# EAGLE schematic d-cube (EAGLE 7.7.0)

## Sheet 1 of 3: Isolation Circuits for USB, Power and GPIO isolation between the Target and the RPI.
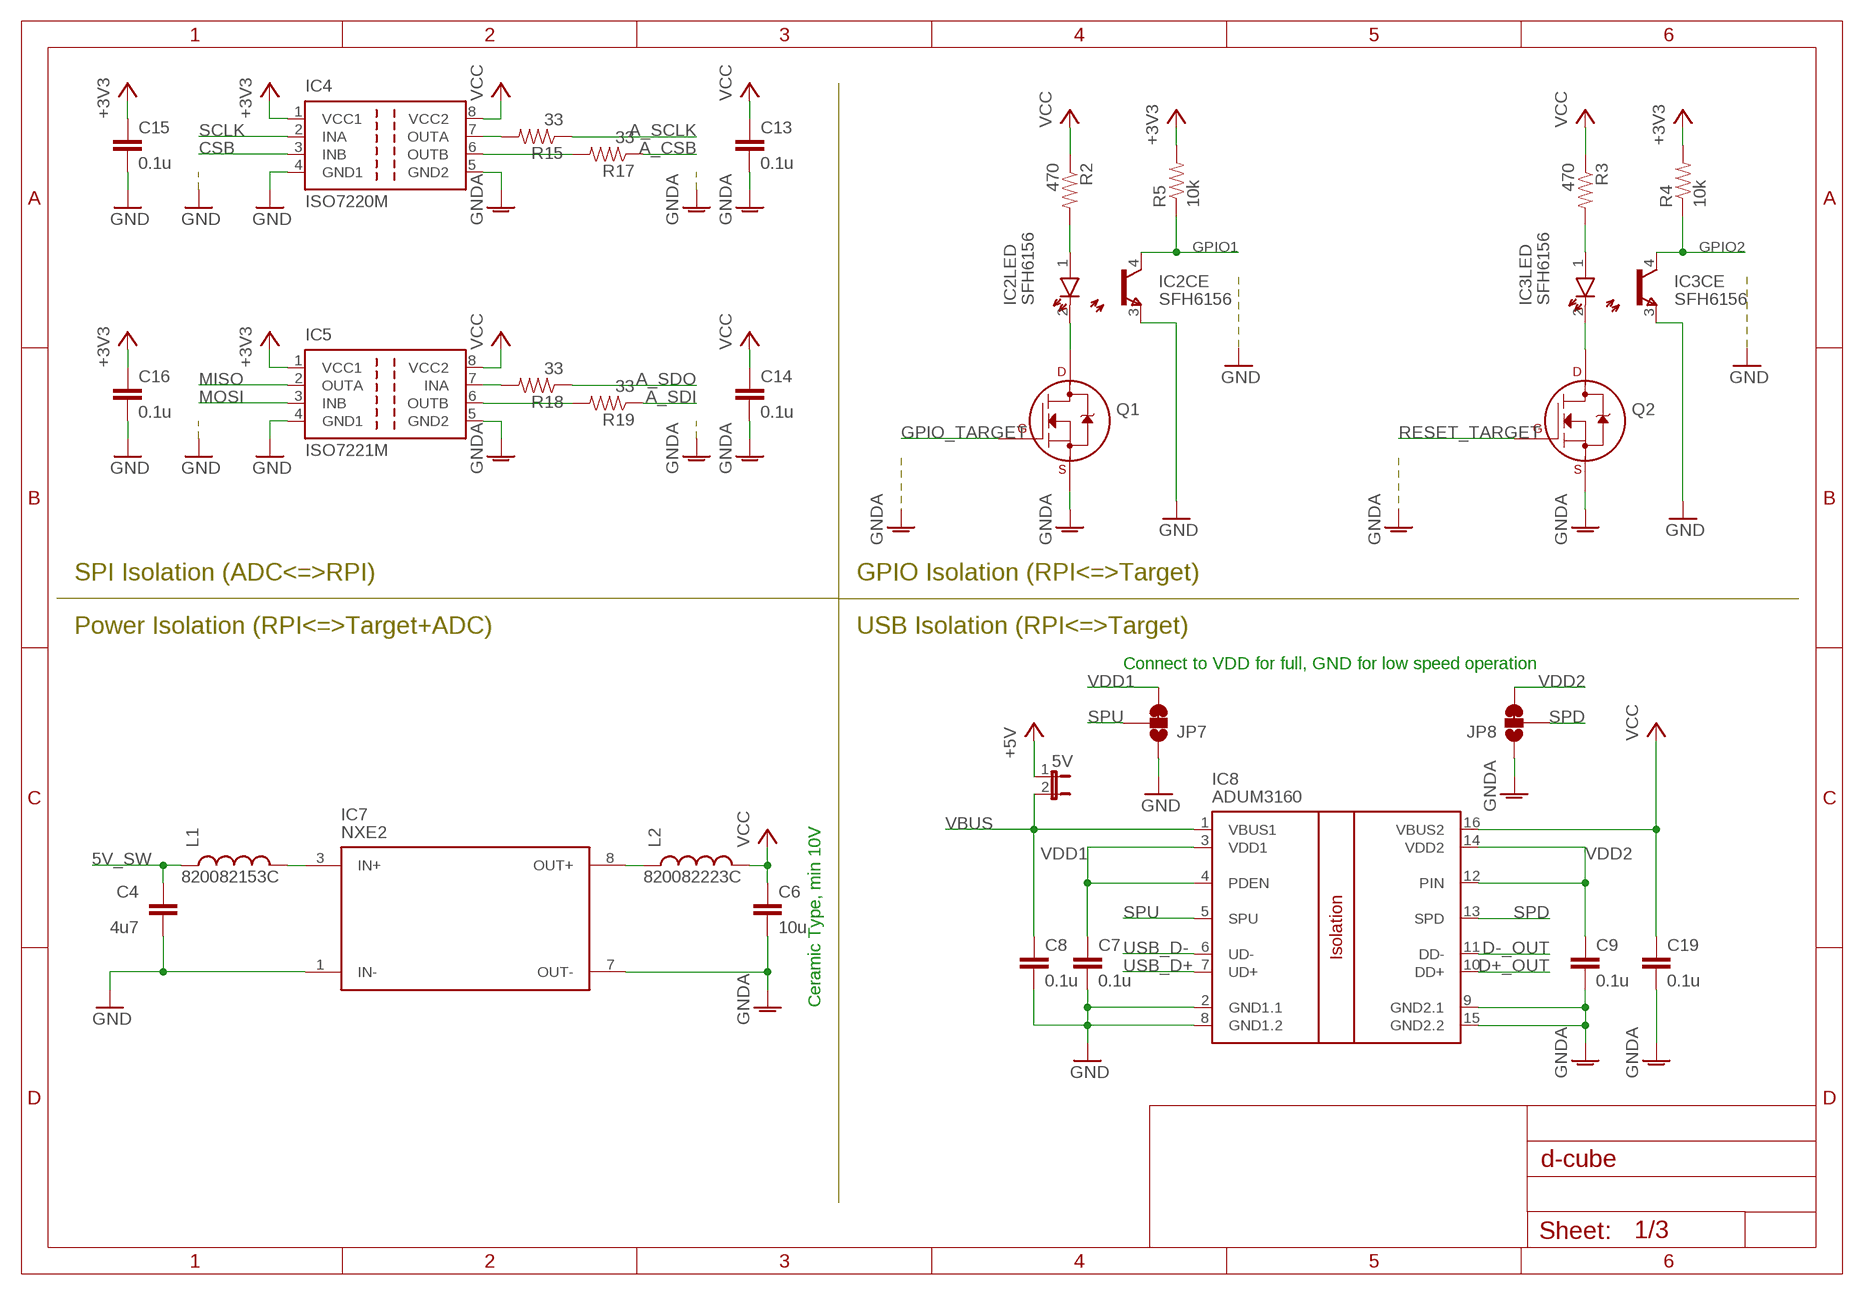
[diagram p0: schematic, sheet 1]

### Parts
5V  JP1E  [JP1]
C4  4u7  CAP0805  [0805]
C6  10u  CAP0805  [0805]
C7  0.1u  CAP0805  [0805]
C8  0.1u  CAP0805  [0805]
C9  0.1u  CAP0805  [0805]
C13  0.1u  CAP0805  [0805]
C14  0.1u  CAP0805  [0805]
C15  0.1u  CAP0805  [0805]
C16  0.1u  CAP0805  [0805]
C19  0.1u  CAP0805  [0805]
IC2  SFH6156  [SFH]
IC3  SFH6156  [SFH]
IC4  ISO7220M  [SO-08]
IC5  ISO7221M  [SO-08]
IC7  NXE2  [NXE2]
IC8  ADUM3160  [SO-16W]
JP7  JUMPER-PAD-3-2OF3_NC_BY_TRACE_LARGE  [PAD-JUMPER-3-2OF3_NC_BY_TRACE_YES_SILK_LARGE]
JP8  JUMPER-PAD-3-2OF3_NC_BY_TRACE_LARGE  [PAD-JUMPER-3-2OF3_NC_BY_TRACE_YES_SILK_LARGE]
L1  820082153C  [8200]
L2  820082223C  [8200]
Q1  2N7002_SOT23  [SOT-23]
Q2  2N7002_SOT23  [SOT-23]
R2  470  RESISTOR0805-RES  [0805]
R3  470  RESISTOR0805-RES  [0805]
R4  10k  RESISTOR0805-RES  [0805]
R5  10k  RESISTOR0805-RES  [0805]
R15  33  RESISTOR0805-RES  [0805]
R17  33  RESISTOR0805-RES  [0805]
R18  33  RESISTOR0805-RES  [0805]
R19  33  RESISTOR0805-RES  [0805]

### Nets
5V_SW: C4.1 L1.P$1 ; also sheet 2
+3V3: C15.1 C16.1 IC4.1(VCC1) IC5.1(VCC1) R4.2 R5.2 ; also sheet 2,3
+5V: 5V.1 ; also sheet 3
A_CSB: R17.1 ; also sheet 2
A_SCLK: R15.1 ; also sheet 2
A_SDI: R19.1 ; also sheet 2
A_SDO: R18.1 ; also sheet 2
CSB: IC4.3(INB) ; also sheet 3
D+_OUT: IC8.10(DD+) ; also sheet 3
D-_OUT: IC8.11(DD-) ; also sheet 3
GND: C4.2 C7.2 C8.2 C15.2 C16.2 IC2.3(CE:E) IC3.3(CE:E) IC4.4(GND1) IC5.4(GND1) IC7.1(IN-) IC8.2(GND1.1) IC8.8(GND1.2) JP7.1 ; also sheet 2,3
GNDA: C6.2 C9.2 C13.2 C14.2 C19.2 IC4.5(GND2) IC5.5(GND2) IC7.7(OUT-) IC8.9(GND2.1) IC8.15(GND2.2) JP8.1 Q1.2(S) Q2.2(S) ; also sheet 2
GPIO1: IC2.4(CE:C) R5.1 ; also sheet 2,3
GPIO2: IC3.4(CE:C) R4.1 ; also sheet 3
GPIO_TARGET: Q1.1(G) ; also sheet 3
MISO: IC5.2(OUTA) ; also sheet 3
MOSI: IC5.3(INB) ; also sheet 3
N$1: IC7.3(IN+) L1.P$2
N$2: IC2.2(LED:K) Q1.3(D)
N$5: IC7.8(OUT+) L2.P$1
N$11: IC2.1(LED:A) R2.2
N$12: IC3.1(LED:A) R3.2
N$14: IC3.2(LED:K) Q2.3(D)
N$17: IC4.7(OUTA) R15.2
N$18: IC4.6(OUTB) R17.2
N$19: IC5.7(INA) R18.2
N$20: IC5.6(OUTB) R19.2
RESET_TARGET: Q2.1(G) ; also sheet 3
SCLK: IC4.2(INA) ; also sheet 3
SPD: IC8.13(SPD) JP8.2
SPU: IC8.5(SPU) JP7.2
USB_D+: IC8.7(UD+) ; also sheet 3
USB_D-: IC8.6(UD-) ; also sheet 3
VBUS: 5V.2 C8.1 IC8.1(VBUS1) ; also sheet 2,3
VCC: C6.1 C13.1 C14.1 C19.1 IC4.8(VCC2) IC5.8(VCC2) IC8.16(VBUS2) L2.P$2 R2.1 R3.1 ; also sheet 2,3
VDD1: C7.1 IC8.3(VDD1) IC8.4(PDEN) JP7.3
VDD2: C9.1 IC8.12(PIN) IC8.14(VDD2) JP8.3

### Notes on the sheet
- SPI Isolation (ADC<=>RPI) | GPIO Isolation (RPI<=>Target)
- Power Isolation (RPI<=>Target+ADC) | USB Isolation (RPI<=>Target)
- Connect to VDD for full, GND for low speed operation
- Ceramic Type, min 10V

## Sheet 2 of 3: Measurement Compoments. Contains the main ADC, the USB power switch and the edge detector required for the Navspark.
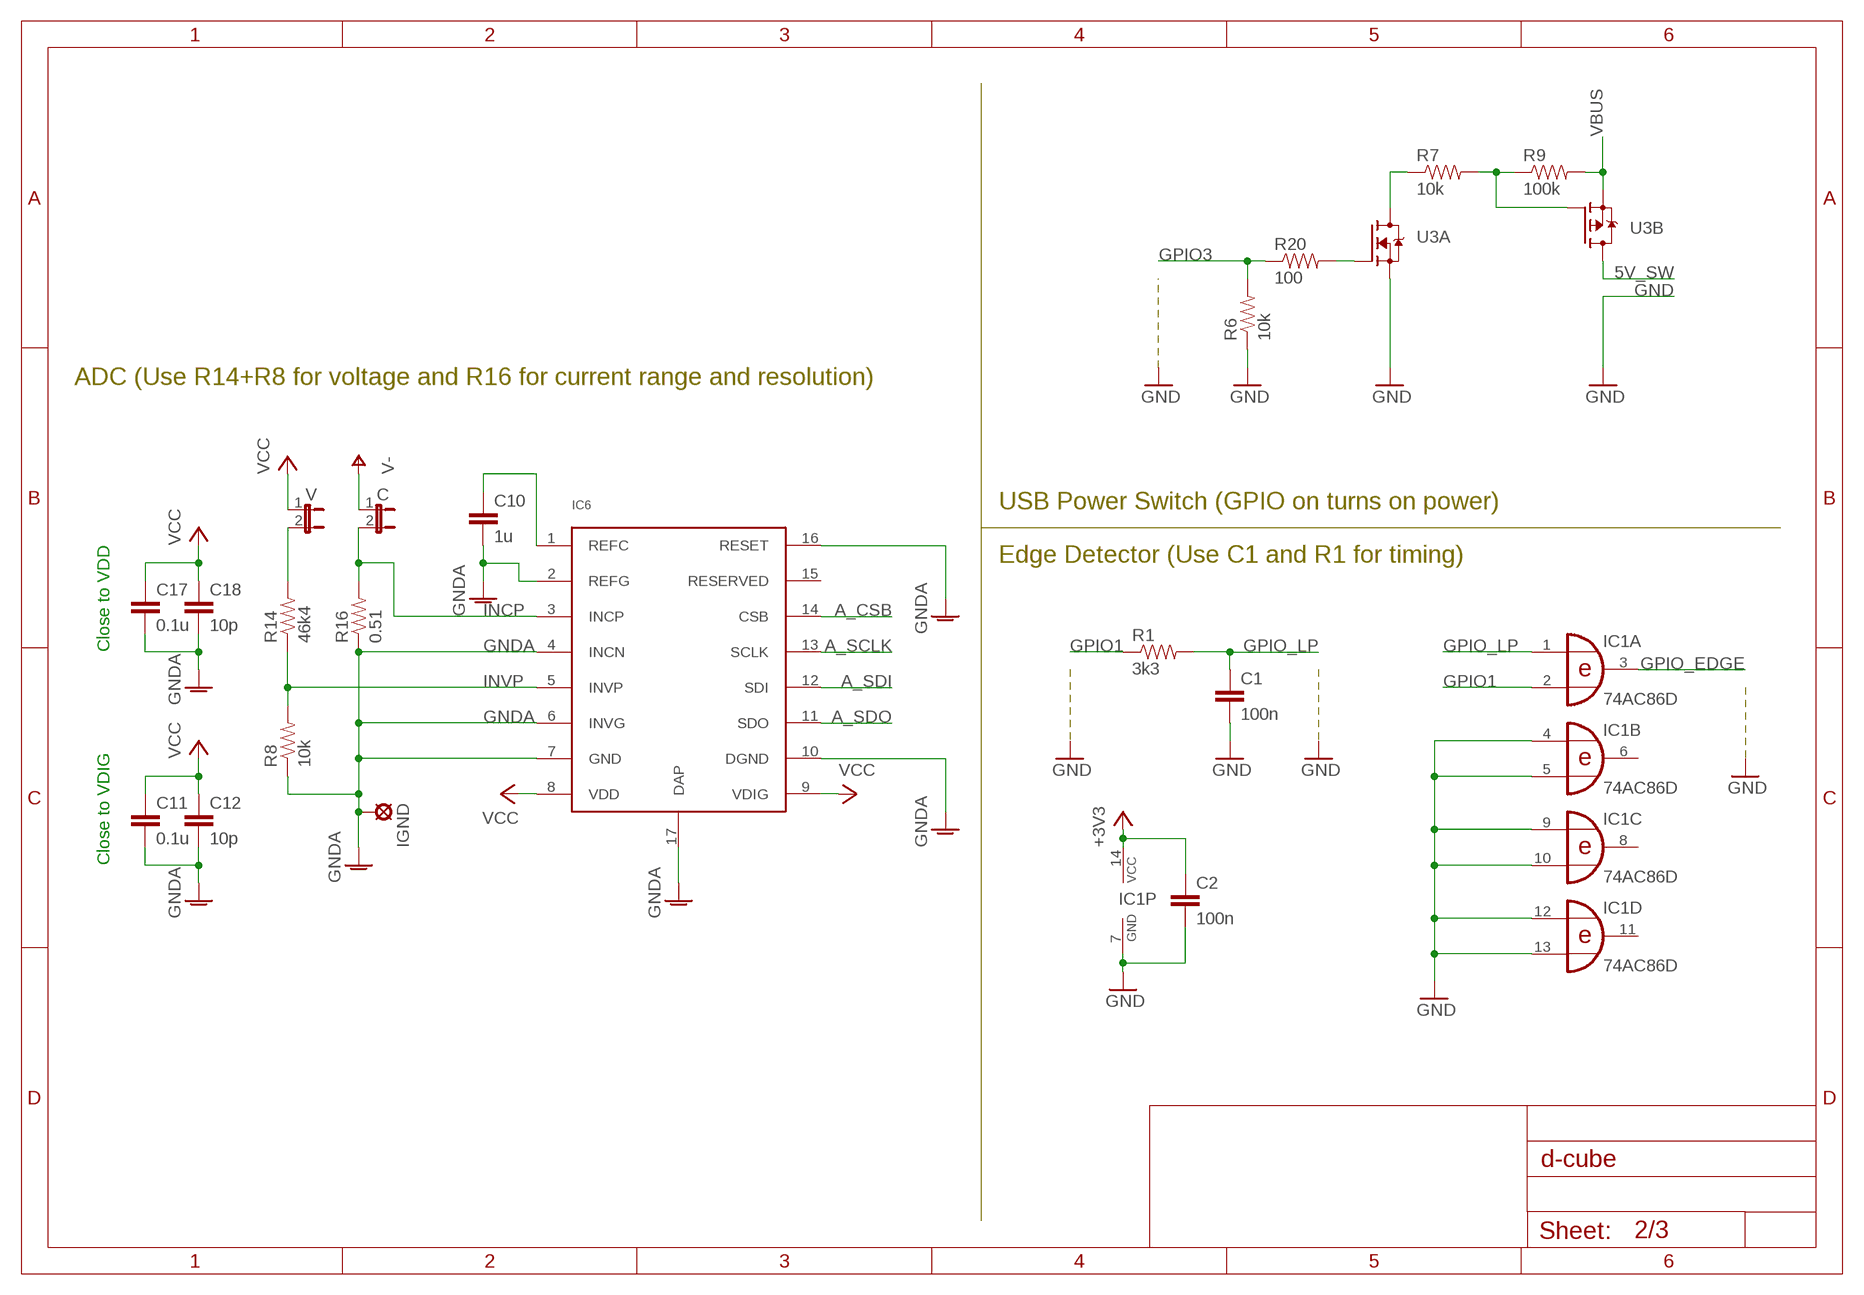
[diagram p1: schematic, sheet 2]

### Parts
C  JP1E  [JP1]
C1  100n  CAP0805  [0805]
C2  100n  CAP0805  [0805]
C10  1u  CAP0805  [0805]
C11  0.1u  CAP0805  [0805]
C12  10p  CAP0805  [0805]
C17  0.1u  CAP0805  [0805]
C18  10p  CAP0805  [0805]
IC1  74AC86D  [SO14]
IC6  LMP92064  [WSON-16]
IGND  LSP10  [LSP10]
R1  3k3  RESISTOR0805-RES  [0805]
R6  10k  RESISTOR0805-RES  [0805]
R7  10k  RESISTOR0805-RES  [0805]
R8  10k  RESISTOR0805-RES  [0805]
R9  100k  RESISTOR0805-RES  [0805]
R14  46k4  RESISTOR0805-RES  [0805]
R16  0.51  RESISTOR1206  [1206]
R20  100  RESISTOR0805-RES  [0805]
U3  COMPLEMENTARY  [SOT-363]
V  JP1E  [JP1]

### Nets
5V_SW: U3.3(B:D) ; also sheet 1
+3V3: C2.1 IC1.14(P:VCC) ; also sheet 1,3
A_CSB: IC6.14(CSB) ; also sheet 1
A_SCLK: IC6.13(SCLK) ; also sheet 1
A_SDI: IC6.12(SDI) ; also sheet 1
A_SDO: IC6.11(SDO) ; also sheet 1
GND: C1.2 C2.2 IC1.4(B:I0) IC1.5(B:I1) IC1.7(P:GND) IC1.9(C:I0) IC1.10(C:I1) IC1.12(D:I0) IC1.13(D:I1) R6.1 U3.1(A:S) ; also sheet 1,3
GNDA: C10.2 C11.2 C12.2 C17.2 C18.2 IC6.2(REFG) IC6.4(INCN) IC6.6(INVG) IC6.7(GND) IC6.10(DGND) IC6.16(RESET) IC6.17(DAP) IGND.MP R8.1 R16.1 ; also sheet 1
GPIO1: IC1.2(A:I1) R1.1 ; also sheet 1,3
GPIO3: R6.2 R20.1 ; also sheet 3
GPIO_EDGE: IC1.3(A:O) ; also sheet 3
GPIO_LP: C1.1 IC1.1(A:I0) R1.2
INCP: C.2 IC6.3(INCP) R16.2
INVP: IC6.5(INVP) R8.2 R14.1
N$3: R20.2 U3.2(A:G)
N$4: R7.2 R9.1 U3.5(B:G)
N$8: R7.1 U3.6(A:D)
N$16: C10.1 IC6.1(REFC)
N$22: R14.2 V.2
V-: C.1 ; also sheet 3
VBUS: R9.2 U3.4(B:S) ; also sheet 1,3
VCC: C11.1 C12.1 C17.1 C18.1 IC6.8(VDD) IC6.9(VDIG) V.1 ; also sheet 1,3
Unconnected: IC1.6(B:O) IC1.8(C:O) IC1.11(D:O) IC6.15(RESERVED)

### Notes on the sheet
- ADC (Use R14+R8 for voltage and R16 for current range and resolution)
- USB Power Switch (GPIO on turns on power)
- Edge Detector (Use C1 and R1 for timing)
- Close to VDD
- Close to VDIG

## Sheet 3 of 3: RPI/NavSpark/Target Connectors
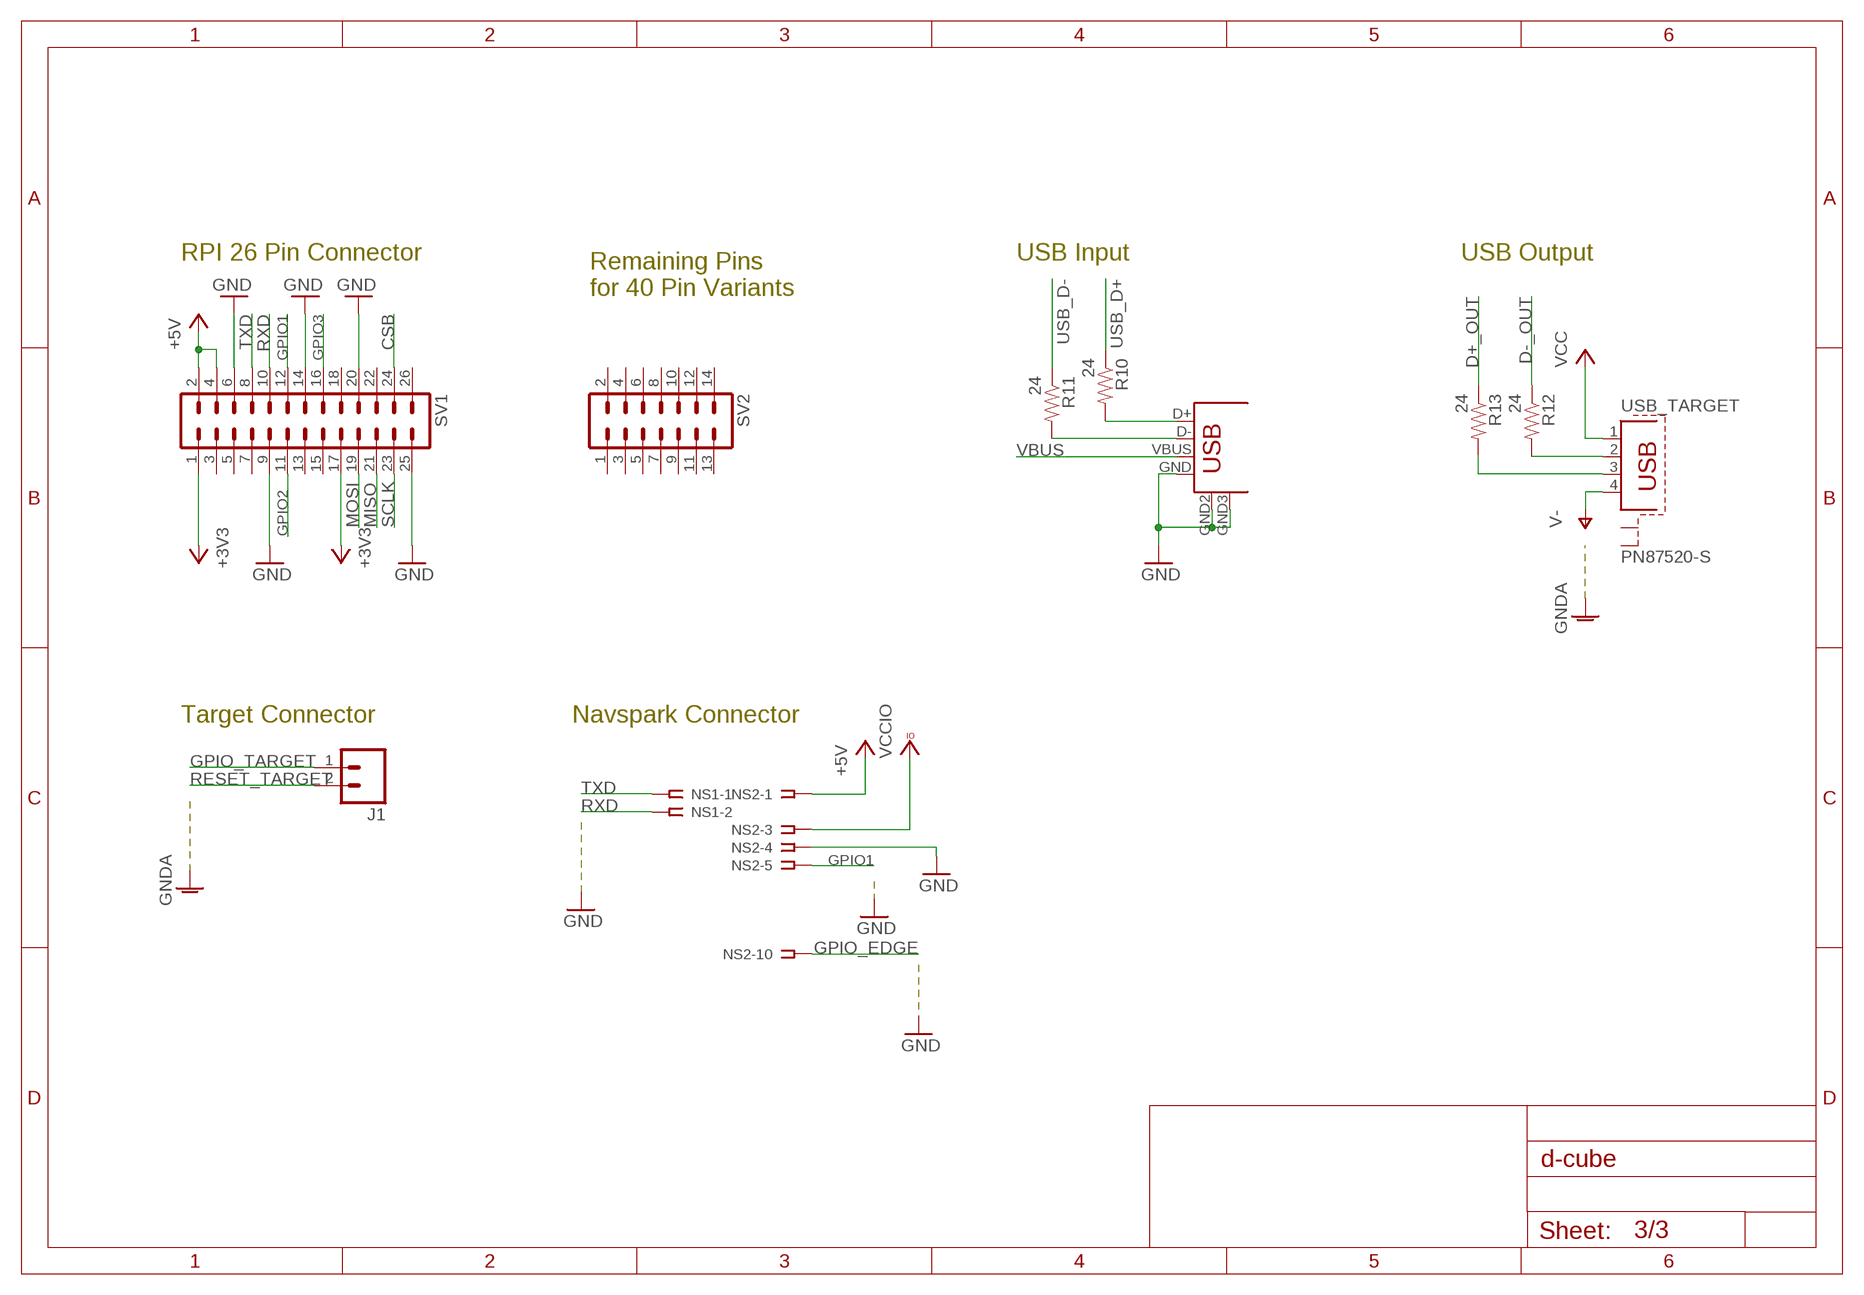
[diagram p2: schematic, sheet 3]

### Parts
J1  M02PTH3  [1X02_LONGPADS]
NS1  SSW-112-02-S-S  [SSW-112-02-S-S]
NS2  SSW-112-02-S-S  [SSW-112-02-S-S]
R10  24  RESISTOR0805-RES  [0805]
R11  24  RESISTOR0805-RES  [0805]
R12  24  RESISTOR0805-RES  [0805]
R13  24  RESISTOR0805-RES  [0805]
SV1  MA13-2  [MA13-2]
SV2  MA07-2  [MA07-2]
USB_PI  USB+SHIELDUSB-A-H-S  [USB-A-H]
USB_TARGET  PN87520-S  [PN87520-S]

### Nets
+3V3: SV1.1 SV1.17 ; also sheet 1,2
+5V: NS2.1 SV1.2 SV1.4 ; also sheet 1
CSB: SV1.24 ; also sheet 1
D+_OUT: R13.1 ; also sheet 1
D+_OUT_TERM: R13.2 USB_TARGET.3
D-_OUT: R12.1 ; also sheet 1
D-_OUT_TERM: R12.2 USB_TARGET.2
GND: NS2.4 SV1.6 SV1.9 SV1.14 SV1.20 SV1.25 USB_PI.GND USB_PI.GND2(S1) USB_PI.GND3(S2) ; also sheet 1,2
GPIO1: NS2.5 SV1.12 ; also sheet 1,2
GPIO2: SV1.11 ; also sheet 1
GPIO3: SV1.16 ; also sheet 2
GPIO_EDGE: NS2.10 ; also sheet 2
GPIO_TARGET: J1.1 ; also sheet 1
MISO: SV1.21 ; also sheet 1
MOSI: SV1.19 ; also sheet 1
RESET_TARGET: J1.2 ; also sheet 1
RXD: NS1.2 SV1.10
SCLK: SV1.23 ; also sheet 1
TXD: NS1.1 SV1.8
USB_D+: R10.1 ; also sheet 1
USB_D+_TERM: R10.2 USB_PI.D+
USB_D-: R11.1 ; also sheet 1
USB_D-_TERM: R11.2 USB_PI.D-
V-: USB_TARGET.4 ; also sheet 2
VBUS: USB_PI.VBUS ; also sheet 1,2
VCC: USB_TARGET.1 ; also sheet 1,2
VCCIO: NS2.3
Unconnected: NS1.3 NS1.4 NS1.5 NS1.6 NS1.7 NS1.8 NS1.9 NS1.10 NS1.11 NS1.12 NS2.2 NS2.6 NS2.7 NS2.8 NS2.9 NS2.11 NS2.12 SV1.3 SV1.5 SV1.7 SV1.13 SV1.15 SV1.18 SV1.22 SV1.26 SV2.1 SV2.2 SV2.3 SV2.4 SV2.5 SV2.6 SV2.7 SV2.8 SV2.9 SV2.10 SV2.11 SV2.12 SV2.13 SV2.14 USB_TARGET.S1 USB_TARGET.S2

### Notes on the sheet
- RPI 26 Pin Connector | USB Input | USB Output
- Remaining Pins 
  for 40 Pin Variants
- Target Connector | Navspark Connector

## Library data of the parts
5V C V = jumper:JP1E: JUMPER
C1 C2 C4 C6-C19 = SparkFun-Passives:CAP: Capacitor Standard 0603 ceramic capacitor, and 0.1" leaded capacitor.
IC1 = 74xx-eu:74*86: Quad 2-input EXCLUSIVE-OR (XOR) gate
IC2 IC3 = optocoupler:SFH6156: 5.3 kV TRIOS High Reliability Optocoupler; MF: VISHAY/TELEFUNKEN; MPN: SFH6156-4T; OC_FARNELL: 1612479; OC_NEWARK: 21H7733
IC4 = texas:ISO7220: DUAL DIGITAL ISOLATORS Source: http://focus.ti.com/lit/ds/symlink/iso7221a.pdf; MPN: ISO7220MD; OC_FARNELL: 1390646; OC_NEWARK: 61M6991
IC5 = texas:ISO7221: DUAL DIGITAL ISOLATORS Source: http://focus.ti.com/lit/ds/symlink/iso7221a.pdf; MPN: ISO7221MD; OC_FARNELL: 1390647; OC_NEWARK: 48M0676
IC6 = LMP9264:LMP92064
IC7 = nx2:NXE2
IC8 = adum3160:ADUM3160
IGND = solpad:LSP10: SOLDER PAD drill 1.0 mm, distributor Buerklin, 12H555
J1 = SparkFun-Connectors:M02: Standard 2-pin 0.1" header. Use with - straight break away headers ( PRT-00116) - right angle break away headers (PRT-00553) - swiss pins (PRT-00743) - machine pins (PRT-00117) - female headers (PRT-00115) Molex polarized connector foot print use with: PRT-08233 with associated crimp pins and housings. 2.54_SCREWTERM for use with PRT-10571. 3.5mm Screw Terminal footprints for PRT-08084 5mm Screw Terminal footprints for use with PRT-08432
JP7 JP8 = SparkFun-Passives:JUMPER-PAD-3-2OF3_NC_BY_TRACE
L1 L2 = 8200:8200
NS1 NS2 = con-samtec:SSW-112-02-S-S: THROUGH-HOLE .025" SQ POST SOCKET Source: Samtec SSW.pdf; MPN: SSW-112-02-S-S; OC_FARNELL: unknown; OC_NEWARK: 11P9515
Q1 Q2 = transistors:2N700*: 2N7000, 2N7002, NDS7002A N-channel enhancement mode MOSFET
R1-R20 = SparkFun-Passives:RESISTOR: Resistor Basic schematic elements and footprints for 0603, 1206, and PTH resistors.
SV1 = con-lstb:MA13-2: PIN HEADER; OC_FARNELL: unknown; OC_NEWARK: unknown
SV2 = con-lstb:MA07-2: PIN HEADER; OC_FARNELL: unknown; OC_NEWARK: unknown
U3 = mos:COMPLEMENTARY
USB_PI = SparkFun-Connectors:USB+SHIELD: USB+Shield USB connector with shield pins connectable
USB_TARGET = con-berg:PN87520-S; OC_FARNELL: unknown; OC_NEWARK: unknown